# EAGLE design xiao-ble-e22-pcb-only (EAGLE 9.6.2)
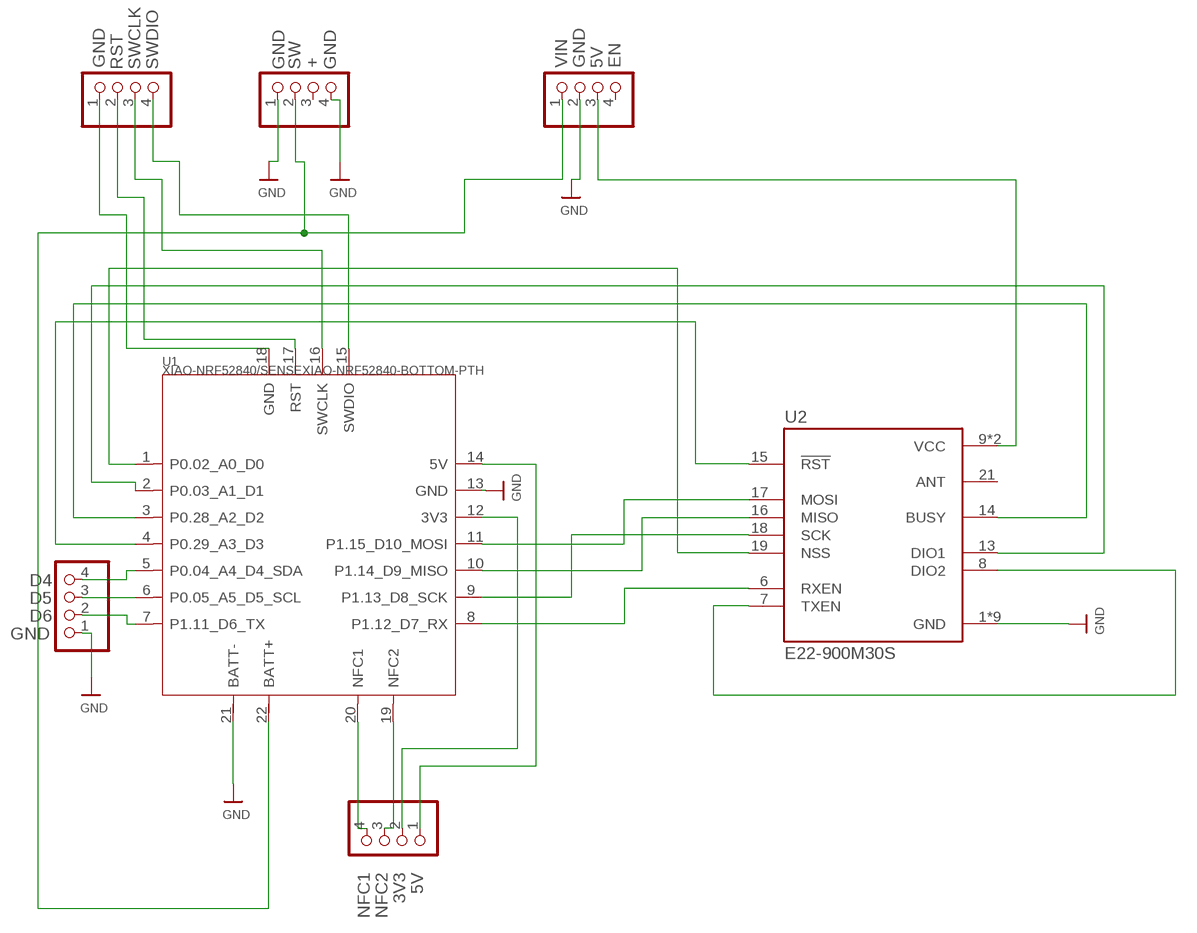
[diagram p0: schematic, sheet 1]

## Parts
JP1  MiniBoost Breakout  PADS-4  [PADS-4]
JP2  GPIO Breakout 1  PADS-4  [PADS-4]
JP3  GPIO Breakout 2  PADS-4  [PADS-4]
JP4  JST + Switch Breakout  PADS-4  [PADS-4]
JP5  GPIO Breakout 2  PADS-4  [PADS-4]
U1  XIAO-NRF52840/SENSEXIAO-NRF52840-BOTTOM-PTH  [XIAO-NRF52840/SENSE-MODULE14P-2.54-21X17.8MM-BOTTOM-PTH]
U2  E22-900M30S  [XCVR_E22-900M30S]

## Nets
GND: JP1.2 JP3.1 JP4.1 JP4.4 U1.13(GND) U1.21(BATT-) U2.1(GND) U2.2(GND) U2.3(GND) U2.4(GND) U2.5(GND) U2.11(GND) U2.12(GND) U2.20(GND) U2.22(GND)
N$1: JP1.3 U2.9(VCC) U2.10(VCC)
N$2: JP2.4 U1.20(NFC1)
N$3: JP2.3 U1.19(NFC2)
N$4: U1.8(P1.12_D7_RX) U2.6(RXEN)
N$5: U2.7(TXEN) U2.8(DIO2)
N$6: U1.1(P0.02_A0_D0) U2.19(NSS)
N$7: U1.9(P1.13_D8_SCK) U2.18(SCK)
N$8: U1.10(P1.14_D9_MISO) U2.16(MISO)
N$9: U1.11(P1.15_D10_MOSI) U2.17(MOSI)
N$10: U1.2(P0.03_A1_D1) U2.13(DIO1)
N$11: U1.3(P0.28_A2_D2) U2.14(BUSY)
N$12: U1.4(P0.29_A3_D3) U2.15(!RST)
N$13: JP1.1 JP4.2 U1.22(BATT+)
N$14: JP5.1 U1.18(GND)
N$15: JP2.1 U1.14(5V)
N$16: JP2.2 U1.12(3V3)
N$17: JP5.2 U1.17(RST)
N$18: JP3.4 U1.5(P0.04_A4_D4_SDA)
N$19: JP3.3 U1.6(P0.05_A5_D5_SCL)
N$20: JP3.2 U1.7(P1.11_D6_TX)
N$21: JP5.3 U1.16(SWCLK)
N$22: JP5.4 U1.15(SWDIO)
Unconnected: JP1.4 JP4.3 U2.21(ANT)

## Library data of the parts
JP1 = breakouts:PADS-4: PIN HEADER; PIN_1: VIN; PIN_2: GND; PIN_3: 5V; PIN_4: EN
JP2 = breakouts:PADS-4: PIN HEADER; PIN_1: 5V; PIN_2: 3V3; PIN_3: NFC2; PIN_4: NFC1
JP3 = breakouts:PADS-4: PIN HEADER; PIN_1: GND; PIN_2: D6; PIN_3: D5; PIN_4: D4
JP4 = breakouts:PADS-4: PIN HEADER; PIN_1: GND; PIN_2: +; PIN_3: SW; PIN_4: GND
JP5 = breakouts:PADS-4: PIN HEADER; PIN_1: GND; PIN_2: RST; PIN_3: SWCLK; PIN_4: SWDIO
U1 = Seeed Studio XIAO Series:XIAO-NRF52840/SENSE: Seeed Studio XIAO nRF52840/Sense - Nordic nRF52840 BLE Microcontroller - 32-bit 64MHz ARM® Cortex® M4+ processor XIAO nRF52840 Seeed SKU: 102010448 Seeed Studio XIAO nRF52840 featuring Nordic nRF52840 MCU supports Bluetooth 5.0 & NFC and is Arduino-compatible. With its exquisite design, Bluetooth and built-in Type-C, it's perfect for TinyML, smart wearable devices, and IoT projects. Buy now <https://www.seeedstudio.com/Seeed-XIAO-BLE-nRF52840-p-5201.html> Wiki <https://wiki.seeedstudio.com/XIAO_BLE/> XIAO nRF52840 Sense Seeed SKU: 102010469 Seeed Studio XIAO nRF52840 Sense is a tiny Bluetooth BLE development board designed for IoT and AI applications. It features an onboard antenna, 6 Dof IMU, microphone, all of which make it an ideal board to run AI using TinyML and TensorFlow Lite. Buy now <https://www.seeedstudio.com/Seeed-XIAO-BLE-Sense-nRF52840-p-5253.html> Wiki <https://wiki.seeedstudio.com/XIAO_BLE/>
U2 = E22-900M30S:E22-900M30S: Check availability <https://pricing.snapeda.com/parts/E22-900M30S/EBYTE/view-part?ref=eda>; AVAILABILITY: Not in stock; DESCRIPTION: SX1262 868/915 MHz 1w SPI LoRa Module; MF: EBYTE; MP: E22-900M30S; PACKAGE: Package; PRICE: None

## Board
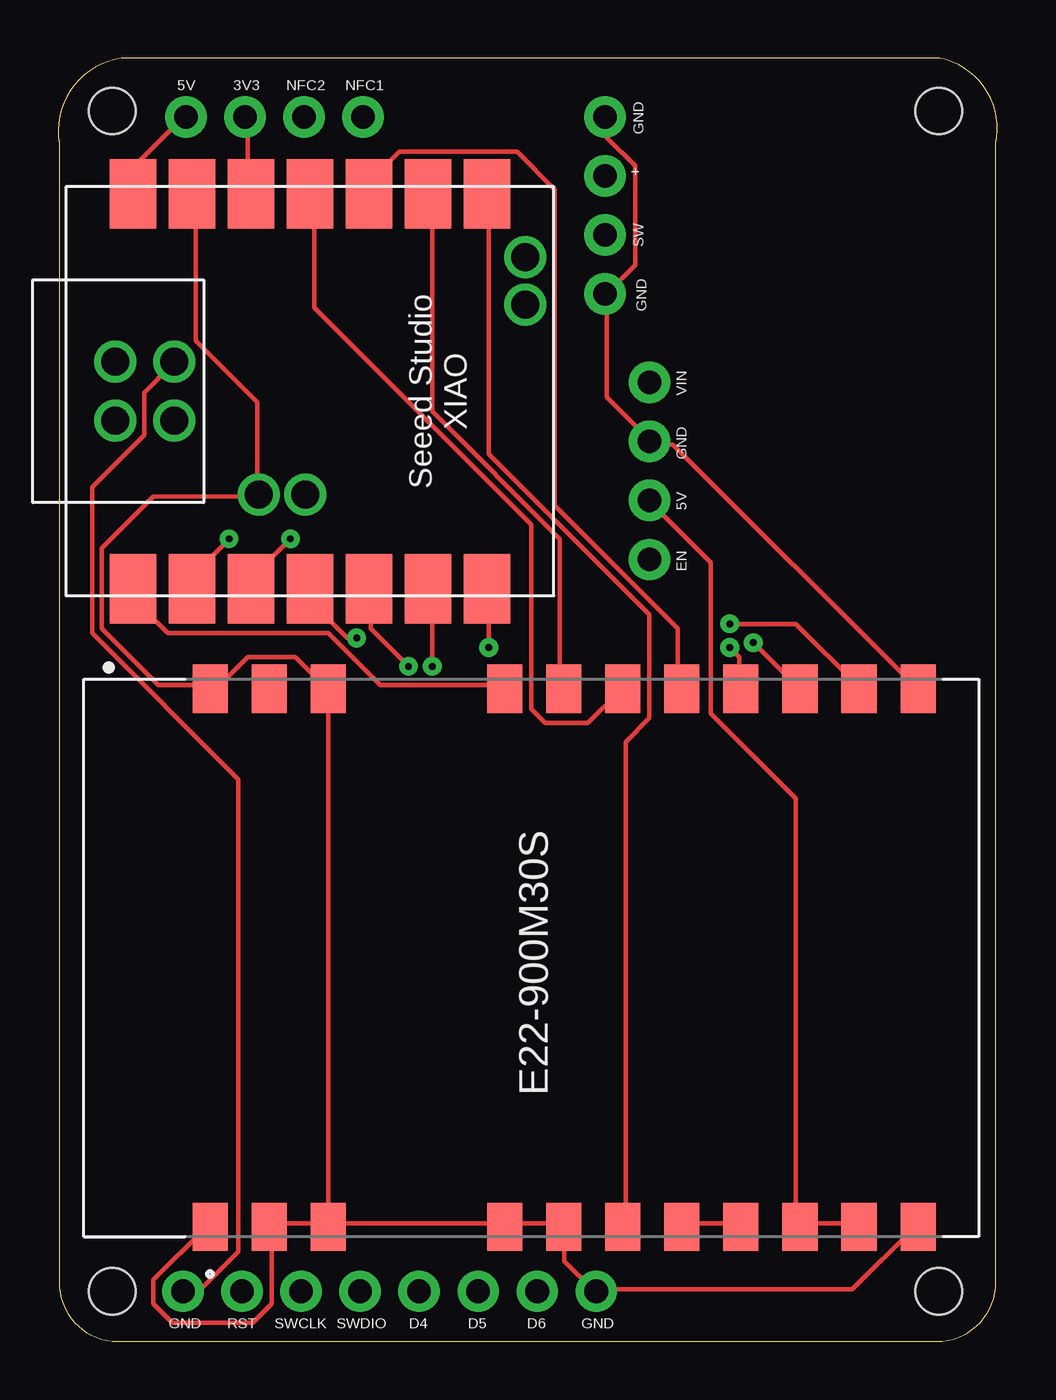
[diagram p1: board, top side]
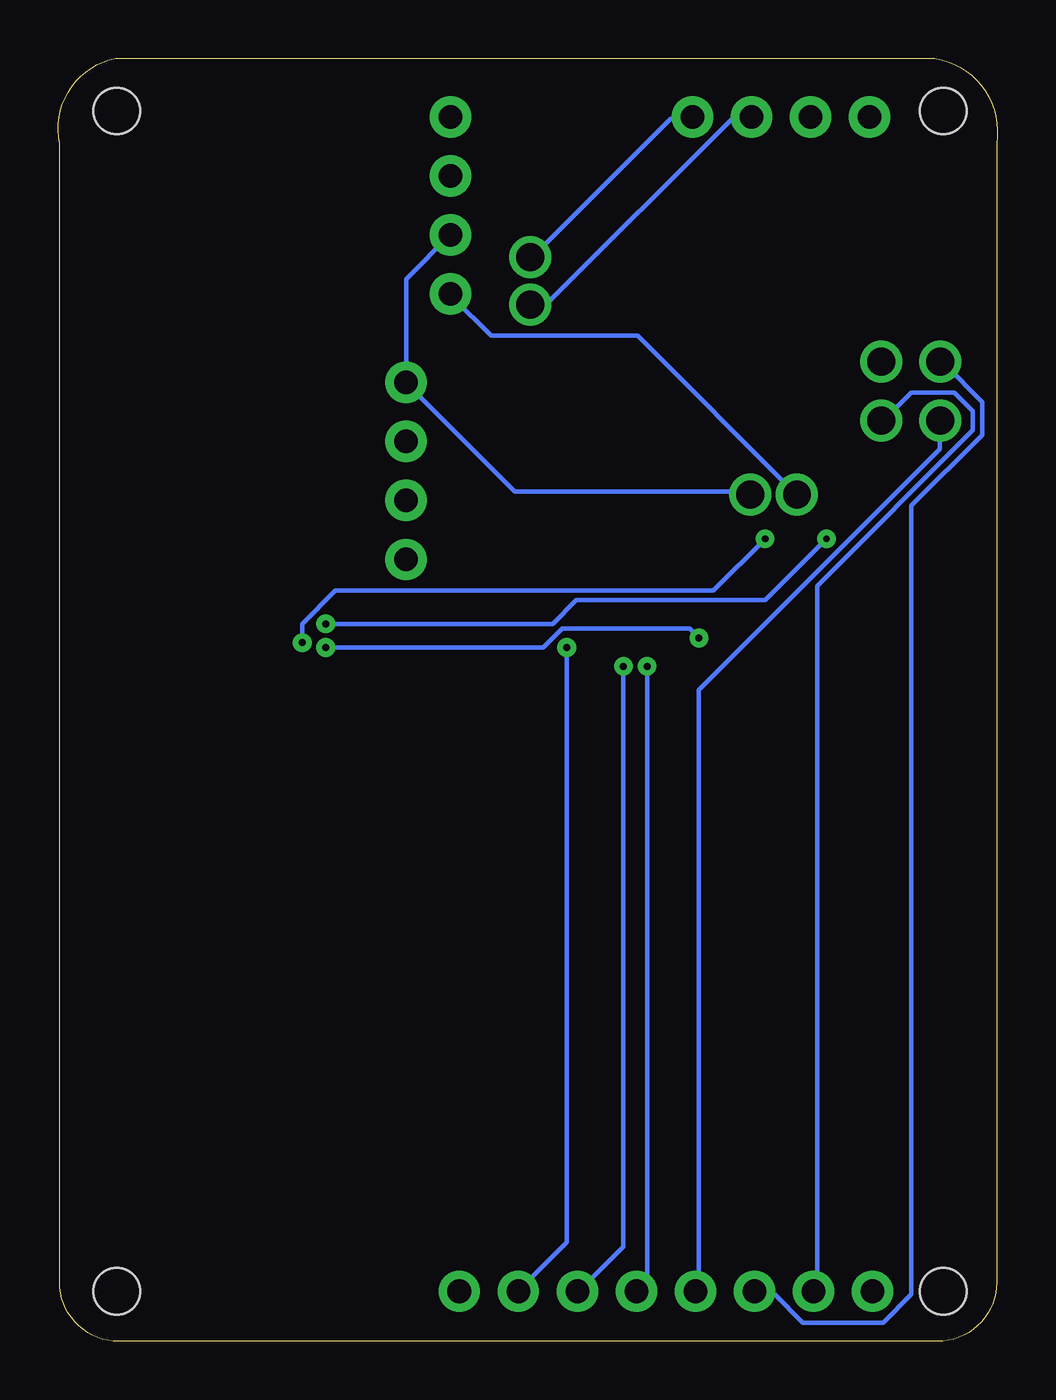
[diagram p2: board, bottom side, seen from below]

Size 40.41 x 55.23 mm. Coordinates in mm from the lower left corner, seen from the top.
Outline: 0.04,51.55 0.04,2.54 arc90 2.58,0 37.81,0 arc90 40.35,2.54 40.35,51.55 arc90 37.94,55.23 2.71,55.23 arc90 0.04,51.55
Copper layers (1*16): Top 0.035mm / dielectric 1.5mm / Bottom 0.035mm
Design rules "SparkFun *": minimum track width 8mil, minimum drill 0.3mm, track to track 8mil, track to pad 8mil, pad to pad 8mil, via to via 8mil, smd to smd 8mil, copper to edge 8mil, drill to drill 8mil, minimum pad ring 12mil, minimum via ring 10mil, stop-mask expansion 4mil, vias tented up to drill 20mil, thermal gap 10mil
Holes 2 mm at 2.33,52.96 2.33,2.16 37.89,52.96 37.89,2.16

### Footprints (pad centres in the part's own frame; a part is rotated, then mirrored left to right if it is on the bottom)
PADS-4 = drill 1.016 pad 1.778: 1 -3.81,0; 2 -1.27,0; 3 1.27,0; 4 3.81,0
XIAO-NRF52840/SENSE-MODULE14P-2.54-21X17.8MM-BOTTOM-PTH = smd 3 x 2: 1 -8.5,7.62; 2 -8.5,5.08; 3 -8.5,2.54; 4 -8.5,0; 5 -8.5,-2.54; 6 -8.5,-5.08; 7 -8.5,-7.62; 8 8.5,-7.62; 9 8.5,-5.08; 10 8.5,-2.54; 11 8.5,0; 12 8.5,2.54; 13 8.5,5.08; 14 8.5,7.62 | drill 1.2: 15 -1.27,8.382; 16 1.27,8.382; 17 -1.27,5.842; 18 1.27,5.842; 19 3.734,-9.271; 20 5.766,-9.271 | drill 1.2 pad 1.676: 21 -4.445,2.21; 22 -4.445,0.203
XCVR_E22-900M30S = smd 2.08 x 1.51: 1 11.575,-13.82; 2 11.575,-11.28; 3 11.575,-8.74; 4 11.575,-1.14; 5 11.575,1.4; 6 11.575,3.94; 7 11.575,6.48; 8 11.575,9.02; 9 11.575,11.56; 10 11.575,14.1; 11 11.575,16.64; 12 -11.575,16.64; 13 -11.575,14.1; 14 -11.575,11.56; 15 -11.575,9.02; 16 -11.575,6.48; 17 -11.575,3.94; 18 -11.575,1.4; 19 -11.575,-1.14; 20 -11.575,-8.74; 21 -11.575,-11.28; 22 -11.575,-13.82

### Placement (x,y rotation side)
JP1  25.44,37.47 270 top
JP2  9.31,52.7 0 top
JP3  19.34,2.16 180 top
JP4  23.53,48.9 90 top
JP5  9.18,2.16 0 top
U1  10.83,40.89 90 top
U2  20.36,16.51 270 top

### Tracks (layer width: path | path; a pad name or v marks a point on that pad's centre or on a via)
GND
  Top 0.203: U2.1 6.34,4.88 4.1,2.64 4.1,1.63 4.92,0.81 8.37,0.81 9.18,1.63 9.18,4.88 U2.2 9.18,5.08 11.42,5.08 U2.3 11.62,5.08 | U2.11 36.82,4.88 34.18,2.23 23.2,2.23 JP3.1 23,2.23 21.78,3.45 21.78,4.88 U2.5 21.58,5.08 19.34,5.08 U2.4 19.14,5.08 11.62,5.08 | U1.13 5.93,49.38 5.93,43.08 8.57,40.44 8.57,36.58 U1.21 8.57,36.37 4.1,36.37 1.87,34.14 1.87,30.68 4.31,28.25 6.34,28.25 U2.22 6.54,28.25 6.95,28.25 8.17,29.46 10.2,29.46 11.42,28.25 U2.20 11.62,28.04 11.62,5.08 | U2.12 36.82,28.25 26.46,38.61 25.44,38.61 JP1.2 25.44,38.81 23.61,40.64 23.61,44.91 JP4.1 23.61,45.11 24.83,46.33 24.83,50.6 23.61,51.82 23.61,52.63 JP4.4
  Bottom 0.203: U1.21 8.78,36.58 15.48,43.28 21.78,43.28 23.41,44.91 JP4.1
N$1
  Top 0.203: U2.10 34.38,5.08 31.94,5.08 U2.9 31.74,5.08 31.74,23.37 28.08,27.03 28.08,33.53 25.44,36.17 JP1.3
N$2
  Bottom 0.203: JP2.4 13.25,52.63 14.06,52.63 19.95,46.74 U1.20
N$3
  Bottom 0.203: JP2.3 10.61,52.63 11.42,52.63 19.34,44.7 19.95,44.7 U1.19
N$4
  Top 0.203: U2.6 24.42,5.08 24.42,25.81 25.44,26.82 25.44,31.29 18.53,38.2 18.53,49.38 U1.8
N$5
  Top 0.203: U2.7 26.86,5.08 29.3,5.08 U2.8
N$6
  Top 0.203: U2.19 19.14,28.25 13.86,28.25 11.62,30.48 4.71,30.48 3.29,31.9 3.29,32.31 U1.1
N$7
  Top 0.203: U2.18 21.58,28.25 21.58,34.54 16.09,40.03 16.09,49.38 U1.9
N$8
  Top 0.203: U2.16 26.66,28.25 26.66,30.68 21.38,35.97 21.38,49.58 19.75,51.21 14.67,51.21 13.45,49.99 13.45,49.58 U1.10
N$9
  Top 0.203: U2.17 24.22,28.04 22.8,26.62 20.97,26.62 20.36,27.23 20.36,35.15 11.01,44.5 11.01,49.38 U1.11
N$10  (via drill 0.3)
  Top 0.203: v28.89,30.89 31.74,30.89 34.38,28.25 U2.13 | v7.35,34.54 5.93,33.12 5.93,32.51 U1.2
  Bottom 0.203: v28.89,30.89 19.14,30.89 18.12,31.9 10,31.9 v7.35,34.54
N$11  (via drill 0.3)
  Top 0.203: v29.91,30.07 31.74,28.25 U2.14 | v10,34.54 8.37,32.92 8.37,32.51 U1.3
  Bottom 0.203: v29.91,30.07 29.91,30.89 28.49,32.31 12.23,32.31 v10,34.54
N$12  (via drill 0.3)
  Top 0.203: v28.89,29.87 29.3,29.46 29.3,28.25 U2.15 | v12.84,30.28 12.43,30.28 11.01,31.7 11.01,32.31 U1.4
  Bottom 0.203: v28.89,29.87 19.55,29.87 18.73,30.68 13.25,30.68 v12.84,30.28
N$13
  Bottom 0.203: JP4.2 25.44,45.72 JP1.1 25.44,41.25 20.77,36.58 10.81,36.58 U1.22
N$14
  Top 0.203: JP5.1 5.53,2.23 6.14,2.23 7.76,3.86 7.76,24.18 1.46,30.48 1.46,36.78 3.7,39.01 3.7,40.84 4.92,42.06 U1.18
N$15
  Top 0.203: U1.14 3.29,49.58 3.29,50.6 5.32,52.63 JP2.1
N$16
  Top 0.203: U1.12 8.17,49.58 8.17,52.63 JP2.2
N$17
  Bottom 0.203: JP5.2 7.76,2.23 7.76,32.51 1.06,39.22 1.06,40.03 1.87,40.84 3.7,40.84 4.92,39.62 U1.17
N$18  (via drill 0.3)
  Top 0.203: v15.08,29.06 13.45,30.68 13.45,32.31 U1.5
  Bottom 0.203: v15.08,29.06 15.08,2.64 15.48,2.23 JP3.4
N$19  (via drill 0.3)
  Top 0.203: v16.09,29.06 16.09,32.31 U1.6
  Bottom 0.203: v16.09,29.06 16.09,4.06 17.92,2.23 JP3.3
N$20  (via drill 0.3)
  Top 0.203: v18.53,29.87 18.53,32.31 U1.7
  Bottom 0.203: v18.53,29.87 18.53,4.27 20.56,2.23 JP3.2
N$21
  Bottom 0.203: JP5.3 10.4,2.03 9.59,2.03 8.37,0.81 4.92,0.81 3.7,2.03 3.7,35.97 0.65,39.01 0.65,40.44 2.27,42.06 U1.16
N$22
  Bottom 0.203: JP5.4 12.84,2.23 12.84,28.04 2.48,38.41 2.48,39.62 U1.15